# Altium project AC Dimming.PrjPcb (part 2 of 2)

## Sheet Sheet2.SchDoc
size A2; SheetNumber: 2; SheetTotal: 2
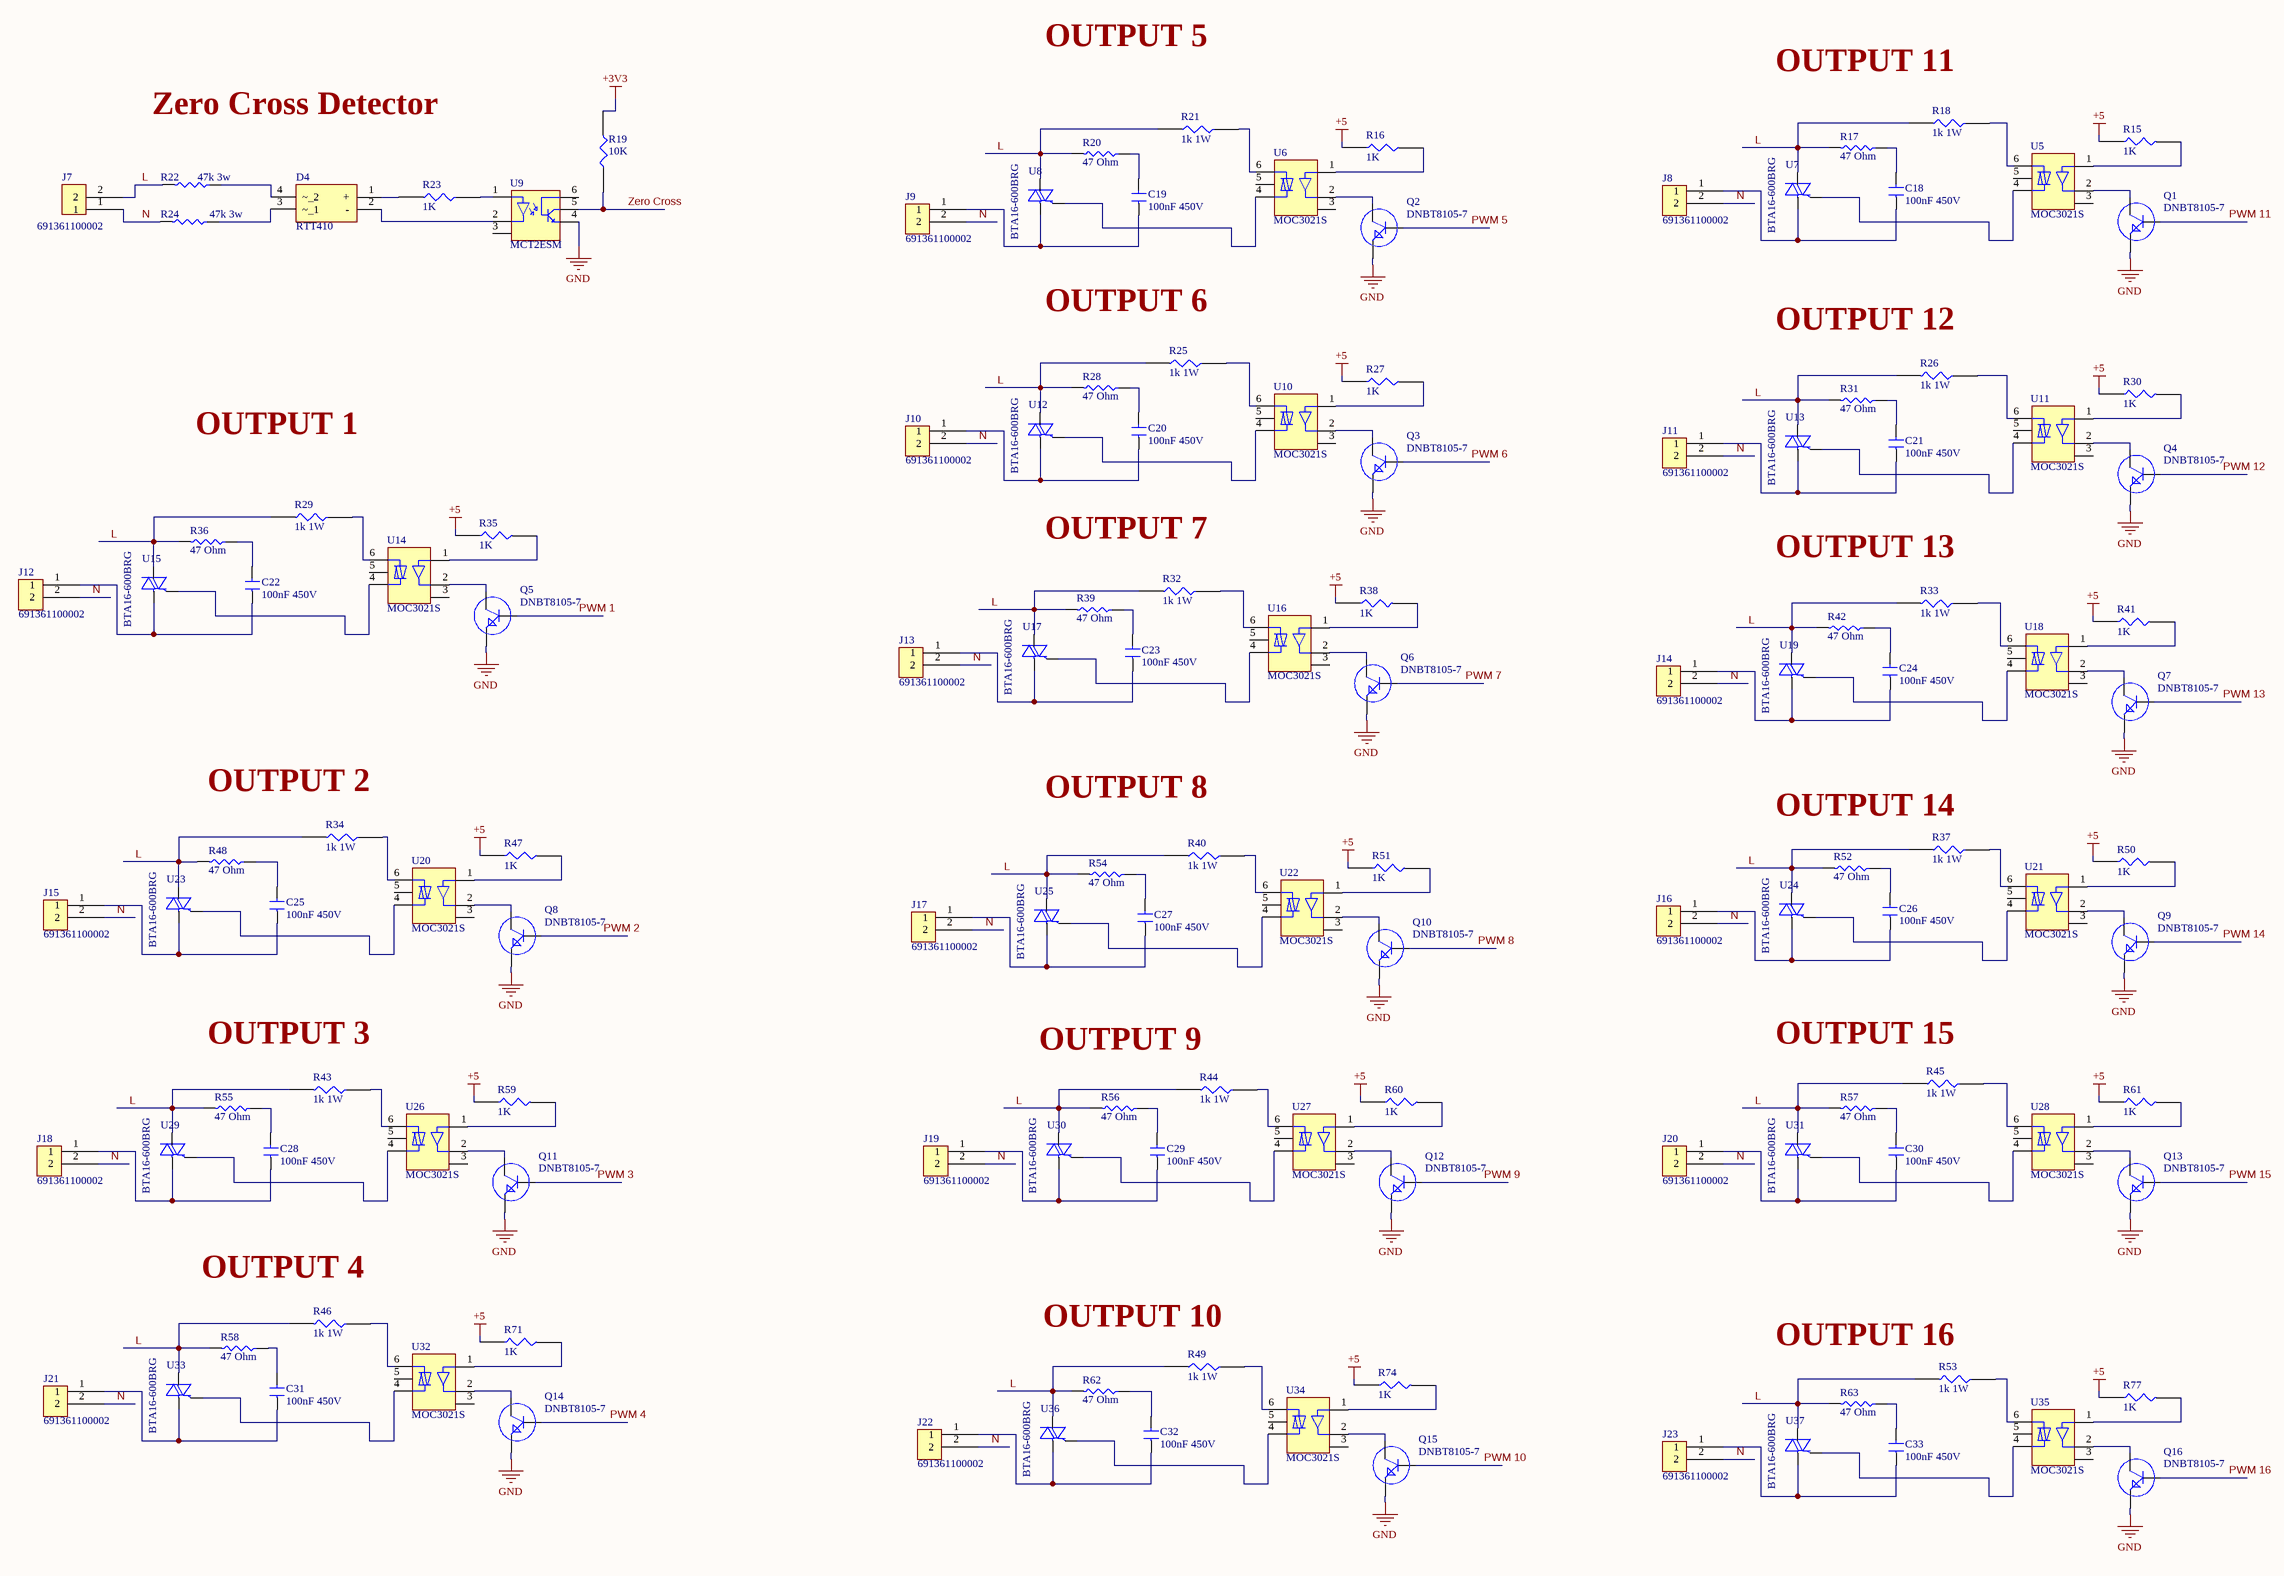
[diagram p1: Sheet2.SchDoc]

### Parts
C18  100nF 450V  [CAP 1206]
C19  100nF 450V  [CAP 1206]
C20  100nF 450V  [CAP 1206]
C21  100nF 450V  [CAP 1206]
C22  100nF 450V  [CAP 1206]
C23  100nF 450V  [CAP 1206]
C24  100nF 450V  [CAP 1206]
C25  100nF 450V  [CAP 1206]
C26  100nF 450V  [CAP 1206]
C27  100nF 450V  [CAP 1206]
C28  100nF 450V  [CAP 1206]
C29  100nF 450V  [CAP 1206]
C30  100nF 450V  [CAP 1206]
C31  100nF 450V  [CAP 1206]
C32  100nF 450V  [CAP 1206]
C33  100nF 450V  [CAP 1206]
D4  RTT410  [RT410]
J7  691361100002  [Screw Terminal 3.5mm]
J8  691361100002  [Screw Terminal 3.5mm]
J9  691361100002  [Screw Terminal 3.5mm]
J10  691361100002  [Screw Terminal 3.5mm]
J11  691361100002  [Screw Terminal 3.5mm]
J12  691361100002  [Screw Terminal 3.5mm]
J13  691361100002  [Screw Terminal 3.5mm]
J14  691361100002  [Screw Terminal 3.5mm]
J15  691361100002  [Screw Terminal 3.5mm]
J16  691361100002  [Screw Terminal 3.5mm]
J17  691361100002  [Screw Terminal 3.5mm]
J18  691361100002  [Screw Terminal 3.5mm]
J19  691361100002  [Screw Terminal 3.5mm]
J20  691361100002  [Screw Terminal 3.5mm]
J21  691361100002  [Screw Terminal 3.5mm]
J22  691361100002  [Screw Terminal 3.5mm]
J23  691361100002  [Screw Terminal 3.5mm]
Q1  DNBT8105-7  [SOT 223 3]
Q2  DNBT8105-7  [SOT 223 3]
Q3  DNBT8105-7  [SOT 223 3]
Q4  DNBT8105-7  [SOT 223 3]
Q5  DNBT8105-7  [SOT 223 3]
Q6  DNBT8105-7  [SOT 223 3]
Q7  DNBT8105-7  [SOT 223 3]
Q8  DNBT8105-7  [SOT 223 3]
Q9  DNBT8105-7  [SOT 223 3]
Q10  DNBT8105-7  [SOT 223 3]
Q11  DNBT8105-7  [SOT 223 3]
Q12  DNBT8105-7  [SOT 223 3]
Q13  DNBT8105-7  [SOT 223 3]
Q14  DNBT8105-7  [SOT 223 3]
Q15  DNBT8105-7  [SOT 223 3]
Q16  DNBT8105-7  [SOT 223 3]
R15  1K  [R_0805]
R16  1K  [R_0805]
R17  47 Ohm  [R 1206]
R18  1k 1W  [R_0805]
R19  10K  [R_0805]
R20  47 Ohm  [R 1206]
R21  1k 1W  [R_0805]
R22  47k 3w  [R 2512]
R23  1K  [R_0805]
R24  47k 3w  [R 2512]
R25  1k 1W  [R_0805]
R26  1k 1W  [R_0805]
R27  1K  [R_0805]
R28  47 Ohm  [R 1206]
R29  1k 1W  [R_0805]
R30  1K  [R_0805]
R31  47 Ohm  [R 1206]
R32  1k 1W  [R_0805]
R33  1k 1W  [R_0805]
R34  1k 1W  [R_0805]
R35  1K  [R_0805]
R36  47 Ohm  [R 1206]
R37  1k 1W  [R_0805]
R38  1K  [R_0805]
R39  47 Ohm  [R 1206]
R40  1k 1W  [R_0805]
R41  1K  [R_0805]
R42  47 Ohm  [R 1206]
R43  1k 1W  [R_0805]
R44  1k 1W  [R_0805]
R45  1k 1W  [R_0805]
R46  1k 1W  [R_0805]
R47  1K  [R_0805]
R48  47 Ohm  [R 1206]
R49  1k 1W  [R_0805]
R50  1K  [R_0805]
R51  1K  [R_0805]
R52  47 Ohm  [R 1206]
R53  1k 1W  [R_0805]
R54  47 Ohm  [R 1206]
R55  47 Ohm  [R 1206]
R56  47 Ohm  [R 1206]
R57  47 Ohm  [R 1206]
R58  47 Ohm  [R 1206]
R59  1K  [R_0805]
R60  1K  [R_0805]
R61  1K  [R_0805]
R62  47 Ohm  [R 1206]
R63  47 Ohm  [R 1206]
R71  1K  [R_0805]
R74  1K  [R_0805]
R77  1K  [R_0805]
U5  MOC3021S  [SMD 6]
U6  MOC3021S  [SMD 6]
U7  BTA16-600BRG  [BAT16]
U8  BTA16-600BRG  [BAT16]
U9  MCT2ESM  [SMD 6]
U10  MOC3021S  [SMD 6]
U11  MOC3021S  [SMD 6]
U12  BTA16-600BRG  [BAT16]
U13  BTA16-600BRG  [BAT16]
U14  MOC3021S  [SMD 6]
U15  BTA16-600BRG  [BAT16]
U16  MOC3021S  [SMD 6]
U17  BTA16-600BRG  [BAT16]
U18  MOC3021S  [SMD 6]
U19  BTA16-600BRG  [BAT16]
U20  MOC3021S  [SMD 6]
U21  MOC3021S  [SMD 6]
U22  MOC3021S  [SMD 6]
U23  BTA16-600BRG  [BAT16]
U24  BTA16-600BRG  [BAT16]
U25  BTA16-600BRG  [BAT16]
U26  MOC3021S  [SMD 6]
U27  MOC3021S  [SMD 6]
U28  MOC3021S  [SMD 6]
U29  BTA16-600BRG  [BAT16]
U30  BTA16-600BRG  [BAT16]
U31  BTA16-600BRG  [BAT16]
U32  MOC3021S  [SMD 6]
U33  BTA16-600BRG  [BAT16]
U34  MOC3021S  [SMD 6]
U35  MOC3021S  [SMD 6]
U36  BTA16-600BRG  [BAT16]
U37  BTA16-600BRG  [BAT16]

### Nets
+3V3: R19.1
+5: R15.2 R16.2 R27.2 R30.2 R35.2 R38.2 R41.2 R47.2 R50.2 R51.2 R59.2 R60.2 R61.2 R71.2 R74.2 R77.2
GND: Q1.2 Q2.2 Q3.2 Q4.2 Q5.2 Q6.2 Q7.2 Q8.2 Q9.2 Q10.2 Q11.2 Q12.2 Q13.2 Q14.2 Q15.2 Q16.2 U9.4
L: J7.2 R17.1 R18.1 R20.1 R21.1 R22.1 R25.1 R26.1 R28.1 R29.1 R31.1 R32.1 R33.1 R34.1 R36.1 R37.1 R39.1 R40.1 R42.1 R43.1 R44.1 R45.1 R46.1 R48.1 R49.1 R52.1 R53.1 R54.1 R55.1 R56.1 R57.1 R58.1 R62.1 R63.1 U7.2(A2) U8.2(A2) U12.2(A2) U13.2(A2) U15.2(A2) U17.2(A2) U19.2(A2) U23.2(A2) U24.2(A2) U25.2(A2) U29.2(A2) U30.2(A2) U31.2(A2) U33.2(A2) U36.2(A2) U37.2(A2)
N: J7.1 J8.2 J9.2 J10.2 J11.2 J12.2 J13.2 J14.2 J15.2 J16.2 J17.2 J18.2 J19.2 J20.2 J21.2 J22.2 J23.2 R24.1
PWM 1: Q5.1
PWM 2: Q8.1
PWM 3: Q11.1
PWM 4: Q14.1
PWM 5: Q2.1
PWM 6: Q3.1
PWM 7: Q6.1
PWM 8: Q10.1
PWM 9: Q12.1
PWM 10: Q15.1
PWM 11: Q1.1
PWM 12: Q4.1
PWM 13: Q7.1
PWM 14: Q9.1
PWM 15: Q13.1
PWM 16: Q16.1
Zero Cross: R19.2 U9.5
NetC18_1: C18.1 J8.1 U7.1(A1)
NetC18_2: C18.2 R17.2
NetC19_1: C19.1 J9.1 U8.1(A1)
NetC19_2: C19.2 R20.2
NetC20_1: C20.1 J10.1 U12.1(A1)
NetC20_2: C20.2 R28.2
NetC21_1: C21.1 J11.1 U13.1(A1)
NetC21_2: C21.2 R31.2
NetC22_1: C22.1 J12.1 U15.1(A1)
NetC22_2: C22.2 R36.2
NetC23_1: C23.1 J13.1 U17.1(A1)
NetC23_2: C23.2 R39.2
NetC24_1: C24.1 J14.1 U19.1(A1)
NetC24_2: C24.2 R42.2
NetC25_1: C25.1 J15.1 U23.1(A1)
NetC25_2: C25.2 R48.2
NetC26_1: C26.1 J16.1 U24.1(A1)
NetC26_2: C26.2 R52.2
NetC27_1: C27.1 J17.1 U25.1(A1)
NetC27_2: C27.2 R54.2
NetC28_1: C28.1 J18.1 U29.1(A1)
NetC28_2: C28.2 R55.2
NetC29_1: C29.1 J19.1 U30.1(A1)
NetC29_2: C29.2 R56.2
NetC30_1: C30.1 J20.1 U31.1(A1)
NetC30_2: C30.2 R57.2
NetC31_1: C31.1 J21.1 U33.1(A1)
NetC31_2: C31.2 R58.2
NetC32_1: C32.1 J22.1 U36.1(A1)
NetC32_2: C32.2 R62.2
NetC33_1: C33.1 J23.1 U37.1(A1)
NetC33_2: C33.2 R63.2
NetD4_1: D4.1(+) R23.1
NetD4_2: D4.2(-) U9.2
NetD4_3: D4.3(~_1) R24.2
NetD4_4: D4.4(~_2) R22.2
NetQ1_3: Q1.3 U5.2
NetQ2_3: Q2.3 U6.2
NetQ3_3: Q3.3 U10.2
NetQ4_3: Q4.3 U11.2
NetQ5_3: Q5.3 U14.2
NetQ6_3: Q6.3 U16.2
NetQ7_3: Q7.3 U18.2
NetQ8_3: Q8.3 U20.2
NetQ9_3: Q9.3 U21.2
NetQ10_3: Q10.3 U22.2
NetQ11_3: Q11.3 U26.2
NetQ12_3: Q12.3 U27.2
NetQ13_3: Q13.3 U28.2
NetQ14_3: Q14.3 U32.2
NetQ15_3: Q15.3 U34.2
NetQ16_3: Q16.3 U35.2
NetR15_1: R15.1 U5.1
NetR16_1: R16.1 U6.1
NetR18_2: R18.2 U5.6
NetR21_2: R21.2 U6.6
NetR23_2: R23.2 U9.1
NetR25_2: R25.2 U10.6
NetR26_2: R26.2 U11.6
NetR27_1: R27.1 U10.1
NetR29_2: R29.2 U14.6
NetR30_1: R30.1 U11.1
NetR32_2: R32.2 U16.6
NetR33_2: R33.2 U18.6
NetR34_2: R34.2 U20.6
NetR35_1: R35.1 U14.1
NetR37_2: R37.2 U21.6
NetR38_1: R38.1 U16.1
NetR40_2: R40.2 U22.6
NetR41_1: R41.1 U18.1
NetR43_2: R43.2 U26.6
NetR44_2: R44.2 U27.6
NetR45_2: R45.2 U28.6
NetR46_2: R46.2 U32.6
NetR47_1: R47.1 U20.1
NetR49_2: R49.2 U34.6
NetR50_1: R50.1 U21.1
NetR51_1: R51.1 U22.1
NetR53_2: R53.2 U35.6
NetR59_1: R59.1 U26.1
NetR60_1: R60.1 U27.1
NetR61_1: R61.1 U28.1
NetR71_1: R71.1 U32.1
NetR74_1: R74.1 U34.1
NetR77_1: R77.1 U35.1
NetU5_4: U5.4 U7.3(G)
NetU6_4: U6.4 U8.3(G)
NetU10_4: U10.4 U12.3(G)
NetU11_4: U11.4 U13.3(G)
NetU14_4: U14.4 U15.3(G)
NetU16_4: U16.4 U17.3(G)
NetU18_4: U18.4 U19.3(G)
NetU20_4: U20.4 U23.3(G)
NetU21_4: U21.4 U24.3(G)
NetU22_4: U22.4 U25.3(G)
NetU26_4: U26.4 U29.3(G)
NetU27_4: U27.4 U30.3(G)
NetU28_4: U28.4 U31.3(G)
NetU32_4: U32.4 U33.3(G)
NetU34_4: U34.4 U36.3(G)
NetU35_4: U35.4 U37.3(G)

Not connected (* = marked no-connect by the designer): U5 3 5; U6 3 5; U9 3 6; U10 3 5; U11 3 5; U14 3 5; U16 3 5; U18 3 5; U20 3 5; U21 3 5; U22 3 5; U26 3 5; U27 3 5; U28 3 5; U32 3 5; U34 3 5; U35 3 5

### Notes on the sheet
- OUTPUT 5
- OUTPUT 11
- Zero Cross Detector
- OUTPUT 6
- (near R26) OUTPUT 12
- OUTPUT 1
- OUTPUT 7
- (near R33) OUTPUT 13
- (near R34) OUTPUT 2
- OUTPUT 8
- (near R37) OUTPUT 14
- OUTPUT 3
- OUTPUT 9
- (near R45) OUTPUT 15
- (near R46) OUTPUT 4
- (near R49) OUTPUT 10
- (near R53) OUTPUT 16

### Library data of the parts
C18-C33 = Cap 100 nf 450V: Multilayer Ceramic Capacitor, 0.1 uF, 450 V, ± 10%, X7T, 1206 [3216 Metric]; Manufacturer: TDK; Manufacturer Part Number: CGA5L4X7T2W104K160AA; Supplier 1: RSComponents; RoHS: Yes; Category: Ceramic Capacitors; Stock 1: 610; Pricing 1: 10=0.47200, 100=0.44400, 250=0.41500, 500=0.39200, 1000=0.35400 (GBP); Mount: Surface Mount; Case/Package: 1206; Case Code (Metric): 3216; Case Code (Imperial): 1206; Weight: 0.000571oz; Min Operating Temperature: -55°C; Max Operating Temperature: 125°C; Capacitance: 100nF; Tolerance: 10%; Voltage Rating: 450V; Packaging: Tape and Reel; Voltage Rating (DC): 450V; Dielectric: X7T; Termination: SMD/SMT; Series: CGA; Package Quantity: 2000; Resistor Type: Ceramic; Length: 3.2mm; Width: 1.6mm; Height: 1.6mm; Thickness: 0.075inch; Depth: 1.6mm; Ratings: AEC-Q200; Lead Free: Lead Free; Reach SVHC Compliant: Yes; RoHS Compliant: Yes; ComponentLink1URL: https://datasheet.ciiva.com/24216/mlcc-automotive-midvoltage-en-355485-24216934.pdf?src-supplier=Mouser; ComponentLink1Description: https://datasheet.ciiva.com/24216/mlcc-automotive-midvoltage-en-355485-24216934.pdf?src-supplier=Mouser; ComponentLink2URL: https://datasheet.ciiva.com/8079/1807242-8079356.pdf?src-supplier=Element14; ComponentLink2Description: https://datasheet.ciiva.com/8079/1807242-8079356.pdf?src-supplier=Element14; Supplier Part Number 1: 9038849
D4 = RTT410: Manufacturer: Diodes; Supplier 1: Avnet; Manufacturer Part Number: RTT410; RoHS: No; Category: Uncategorized; Stock 1: 6000; Pricing 1: 1500=0.10358, 3000=0.09986, 6000=0.09686, 9000=0.09403, 12000=0.09050, 15000=0.08908, 150000=0.08767 (USD); Supplier Part Number 1: RTT410
J7-J23 = Screw Tarminal 3.5mm pitch: 3611 Series 3.5mm Pitch Straight Pluggable Term Block; Plug; Cable Mount; 2 Way; Manufacturer: Wurth Electronics; Current Rating: 10A; Voltage Rating: 300V; Number of Positions Per Level: 2; Number of Levels: 1; Wire/Cable Gauge: 26AWG; Wire Gauge (Min): 16AWG; Pitch: 0.138inch; Stripping Length: -7mm; Supplier 1: RSComponents; Manufacturer Part Number: 691361100002; RoHS: Yes; Category: Terminal Blocks; Stock 1: 1; Pricing 1: 1=2.51400, 10=2.28700, 50=2.12400, 100=2.02300, 250=1.93500 (USD); Mount: Free Hanging; Color: Green; Contact Material: Brass; Package Quantity: 650; Packaging: Bulk; Termination: Screw; Current: 10A; Voltage: 300V; Number of Contacts: 2; Series: WR-TBL Series 3611; Length: 15.8mm; Width: 3.5mm; Height: 11.1mm; Wire Gauge (Max): 26AWG; REACH SVHC: Unknown; RoHS Compliant: Yes; Lead Free: Lead Free; ComponentLink1URL: https://datasheet.ciiva.com/7992/1442235-7992395.pdf?src-supplier=Element14; ComponentLink1Description: https://datasheet.ciiva.com/7992/1442235-7992395.pdf?src-supplier=Element14; ComponentLink2URL: https://datasheet.ciiva.com/796/6913611000xx-796028.pdf?src-supplier=Digi-Key; ComponentLink2Description: https://datasheet.ciiva.com/796/6913611000xx-796028.pdf?src-supplier=Digi-Key; Supplier Part Number 1: 8250806
Q1-Q16 = NPN 1A: TRANS NPN 60V 1A SOT23-3; Manufacturer: Diodes Zetex; Number of Terminals/Pins: 3; Package Body Material: Plastic; Transistor Element Material: SILICON; Max Power Dissipation: 600mW; Collector Base Voltage (VCBO): 80V; hFE Min: 30; Number of Elements: 1; Frequency: 150MHz; Emitter Base Voltage (VEBO): 5V; Collector Emitter Saturation Voltage: 500mV; Power Dissipation: 300mW; Element Configuration: Single; Time @ Peak Reflow Temperature-Max (s): 10s; Transistor Application: SWITCHING; Additional Feature: HIGH RELIABILITY; Supplier 1: RSComponents; Manufacturer Part Number: DNBT8105-7; RoHS: Yes; Category: BJTs; Stock 1: 1; Pricing 1: 50=0.36000, 600=0.17300, 1500=0.16800 (USD); Mount: Surface Mount; Case/Package: SOT-23; Number of Pins: 3; Weight: 0.000282oz; Contact Plating: Tin,Matte; Terminal Finish: Tin; Package Shape: Rectangular; Min Operating Temperature: -55°C; Max Operating Temperature: 150°C; Collector Emitter Voltage (VCEO): 60V; Max Collector Current: 1A; Packaging: Tape and Reel; Package Quantity: 3000; Polarity: NPN; Collector Emitter Breakdown Voltage: 60V; Transition Frequency: 150MHz; Max Breakdown Voltage: 60V; Gain Bandwidth Product: 150MHz; Voltage Rating (DC): 60V; Current Rating: 1A; Collector-emitter Voltage-Max: 500mV; Series: -; Moisture Sensitivity Level: 1; JESD-30 Code: R-PDSO-G3; Surface Mount: Yes; Terminal Form: Gull Wing; Terminal Position: DUAL; Peak Reflow Temperature (Cel): 260°C; DC Current Gain-Min (hFE): 30; Length: 2.9mm; Width: 1.3mm; Height: 1mm; Radiation Hardening: No; REACH SVHC: No SVHC; Lead Free: Lead Free; RoHS Compliant: Yes; ComponentLink1URL: https://datasheet.ciiva.com/34302/1590567-34302596.pdf?src-supplier=Jameco; ComponentLink1Description: https://datasheet.ciiva.com/34302/1590567-34302596.pdf?src-supplier=Jameco; ComponentLink2URL: https://datasheet.ciiva.com/22711/ds30513-22711715.pdf?src-supplier=Element14; ComponentLink2Description: https://datasheet.ciiva.com/22711/ds30513-22711715.pdf?src-supplier=Element14; ComponentLink3URL: https://datasheet.ciiva.com/11201/ds30513-11201713.pdf?src-supplier=Avnet; ComponentLink3Description: https://datasheet.ciiva.com/11201/ds30513-11201713.pdf?src-supplier=Avnet; ComponentLink4URL: https://datasheet.ciiva.com/8029/ds30513-8029483.pdf?src-supplier=Element14; ComponentLink4Description: https://datasheet.ciiva.com/8029/ds30513-8029483.pdf?src-supplier=Element14; Supplier Part Number 1: 7114923P
R15 R16 R23 R27 R30 R35 R38 R41 R47 R50 R51 R59-R61 R71 R74 R77 = RES_1_K_0805: 贴片电阻 1000Ω ± 1.00% 0.125W ± 100ppm/℃ 0805; Manufacturer: Yageo; Manufacturer Part Number: RC0805FR-071KL; Tolerance: 1%; Resistance: 1kR; Temperature Coefficient: 100ppm/°C; Voltage Rating (DC): 150V; Power Rating: 125mW; Supplier 1: Future Electronics; RoHS: Yes; Category: Chip SMD Resistors; Stock 1: 10195000; Pricing 1: 5000=0.00390 (USD); Case/Package: 0805; Number of Pins: 2; Case Code (Metric): 2012; Case Code (Imperial): 0805; Size Code: 0805; Min Operating Temperature: -55°C; Max Operating Temperature: 155°C; Packaging: Tape and Reel; Resistor Type: Thick Film; Package Quantity: 1; Voltage Rating: 150V; Number of Terminations: 2; Termination: SMD/SMT; Max Power Dissipation: 125mW; Features: Moisture Resistant; Series: RC; Resistance Tolerance: 1%; Construction: Rectangular; Length: 0.079inch; Width: 0.049inch; Height: 0.024inch; Depth: 1.25mm; REACH SVHC: Unknown; Lead Free: Lead Free; RoHS Compliant: Yes; Military Standard: Not; ComponentLink1URL: https://datasheet.ciiva.com/7941/1686128-7941719.pdf?src-supplier=Element14; ComponentLink1Description: https://datasheet.ciiva.com/7941/1686128-7941719.pdf?src-supplier=Element14; ComponentLink2URL: https://datasheet.ciiva.com/46385/444164-46385020.pdf?src-supplier=Element14; ComponentLink2Description: https://datasheet.ciiva.com/46385/444164-46385020.pdf?src-supplier=Element14; ComponentLink3URL: https://datasheet.ciiva.com/2456/pyu-r-int-thick-7-2456976.pdf?src-supplier=Digi-Key; ComponentLink3Description: https://datasheet.ciiva.com/2456/pyu-r-int-thick-7-2456976.pdf?src-supplier=Digi-Key; ComponentLink4URL: https://datasheet.ciiva.com/2456/pyu-r-int-thick-7-2456977.pdf?src-supplier=Digi-Key; ComponentLink4Description: https://datasheet.ciiva.com/2456/pyu-r-int-thick-7-2456977.pdf?src-supplier=Digi-Key; ComponentLink5URL: https://datasheet.ciiva.com/2456/pyu-r-int-thick-7-2456975.pdf?src-supplier=Digi-Key; ComponentLink5Description: https://datasheet.ciiva.com/2456/pyu-r-int-thick-7-2456975.pdf?src-supplier=Digi-Key; ComponentLink6URL: https://datasheet.ciiva.com/16850/rc0805-16850409.pdf?src-supplier=Future+Electronics; ComponentLink6Description: https://datasheet.ciiva.com/16850/rc0805-16850409.pdf?src-supplier=Future+Electronics; Supplier Part Number 1: 8126013
R17 R20 R28 R31 R36 R39 R42 R48 R52 R54-R58 R62 R63 = Res 47 oHm 1/2 W: Res Thick Film 1206 47 Ohm 1% 1/2W ±200ppm/°C Molded SMD Paper T/R; Manufacturer: TE Connectivity; Manufacturer Part Number: CRGH1206F47R; Resistance: 47R; Power Rating: 500mW; Voltage Rating: 200V; Number of Resistors: 1; Supplier 1: Digi-Key; RoHS: Yes; Category: Chip SMD Resistors; Stock 1: 107811; Pricing 1: 1=0.17000, 10=0.14200, 100=0.05540, 1000=0.02318, 2500=0.02124 (USD); Mount: Surface Mount; Case/Package: 1206; Case Code (Metric): 3216; Case Code (Imperial): 1206; Min Operating Temperature: -55°C; Max Operating Temperature: 155°C; Tolerance: 1%; Packaging: Tape and Reel; Resistor Type: Thick Film; Temperature Coefficient: 200ppm/°C; Number of Terminations: 2; Termination: Solder; Series: CRGH, Neohm; Max Power Dissipation: 500mW; Voltage Rating (DC): 200V; Resistance Tolerance: 1%; ELV: Compliant; RoHS Compliant: Yes; Reach SVHC Compliant: Yes; ComponentLink1URL: http://farnell.com//datasheets/1755795.pdf?src-supplier=Farnell; ComponentLink1Description: http://farnell.com//datasheets/1755795.pdf?src-supplier=Farnell; ComponentLink2URL: http://www.farnell.com/datasheets/1755795.pdf?src-supplier=Farnell; ComponentLink2Description: http://www.farnell.com/datasheets/1755795.pdf?src-supplier=Farnell; ComponentLink3URL: https://www.te.com/commerce/DocumentDelivery/DDEController?Action=srchrtrv&amp;DocNm=1773204-1&amp;DocType=DS&amp;DocLang=English&src-supplier=Digi-Key; ComponentLink3Description: https://www.te.com/commerce/DocumentDelivery/DDEController?Action=srchrtrv&amp;DocNm=1773204-1&amp;DocType=DS&amp;DocLang=English&src-supplier=Digi-Key; ComponentLink4URL: http://www.farnell.com/datasheets/1755795.pdf?src-supplier=Element14; ComponentLink4Description: http://www.farnell.com/datasheets/1755795.pdf?src-supplier=Element14; ComponentLink5URL: http://www.te.com/commerce/DocumentDelivery/DDEController?Action=srchrtrv&DocNm=1309350_PASSIVE_COMPONENT&DocType=CS&DocLang=English&src-supplier=Digi-Key; ComponentLink5Description: http://www.te.com/commerce/DocumentDelivery/DDEController?Action=srchrtrv&DocNm=1309350_PASSIVE_COMPONENT&DocType=CS&DocLang=English&src-supplier=Digi-Key; Supplier Part Number 1: A129227CT-ND
R18 R21 R25 R26 R29 R32-R34 R37 R40 R43-R46 R49 R53 = Res 1K 1W: Manufacturer: TE Connectivity; Manufacturer Part Number: RA73F2A1K0BTD; Supplier 1: Digi-Key; RoHS: No; Category: Chip SMD Resistors; Stock 1: 7849; Pricing 1: 1=1.46000, 10=1.29300, 100=0.93830, 1000=0.55466, 2500=0.54215 (USD); Supplier Part Number 1: 1712-RA73F2A1K0BTDCT-ND
R19 = RES_10_K_0805: 贴片电阻 10000Ω ± 1.00% 0.125W ± 100ppm/℃ 0805; Manufacturer: Yageo; Manufacturer Part Number: RC0805FR-0710KL; Resistance: 10kR; Tolerance: 1%; Temperature Coefficient: 100ppm/°C; Power Rating: 125mW; Voltage Rating: 150V; Supplier 1: Avnet; RoHS: Yes; Category: Chip SMD Resistors; Stock 1: 725000; Pricing 1: 5000=0.00227, 10000=0.00224, 20000=0.00217 (USD); Case/Package: 0805; Case Code (Imperial): 0805; Case Code (Metric): 2012; Size Code: 0805; Min Operating Temperature: -55°C; Max Operating Temperature: 155°C; Packaging: Tape and Reel; Resistor Type: Thick Film; Package Quantity: 1; Termination: SMD/SMT; Number of Terminations: 2; Max Power Dissipation: 125mW; Features: Moisture Resistant; Series: RC; Construction: Rectangular; Resistance Tolerance: 1%; Technology: THICK FILM; Length: 2mm; Width: 0.049inch; Height: 0.024inch; Depth: 1.25mm; REACH SVHC: Unknown; Lead Free: Lead Free; Military Standard: Not; RoHS Compliant: Yes; Supplier Part Number 1: RC0805FR-0710KL
R22 R24 = RES 47K 3W SMD: Res Thick Film 2512 47K Ohm 5% 3W ±100ppm/C Pad SMD T/R; Manufacturer: TE Connectivity CGS; Manufacturer Part Number: 352247KJT; Resistance: 47kR; Voltage Rating: 250V; Number of Resistors: 1; Temperature Coefficient: 100ppm/°C; Supplier 1: Avnet; RoHS: Yes; Category: Chip SMD Resistors; Stock 1: 32; Pricing 1: 1=0.45000 (USD); Mount: Surface Mount; Case/Package: 2512; Case Code (Metric): 6432; Case Code (Imperial): 2512; Min Operating Temperature: -55°C; Max Operating Temperature: 155°C; Power Rating: 3W; Packaging: Tape and Reel; Resistor Type: Thick Film,Power resistor; Termination: Solder; Tolerance: 5%; Voltage Rating (DC): 250V; Number of Terminations: 2; Features: Automotive AEC-Q200; Series: 3522, CGS; Max Power Dissipation: 3W; Resistance Tolerance: 5%; Technology: THICK FILM; Length: 6.35mm; Height: 1.1mm; Depth: 3.2mm; Ratings: AEC-Q200; RoHS Compliant: Yes; ComponentLink1URL: http://www.farnell.com/datasheets/2007092.pdf?src-supplier=Farnell; ComponentLink1Description: http://www.farnell.com/datasheets/2007092.pdf?src-supplier=Farnell; ComponentLink2URL: http://uk.rs-online.com/webdocs/142d/0900766b8142d139.pdf?src-supplier=RSComponents; ComponentLink2Description: http://uk.rs-online.com/webdocs/142d/0900766b8142d139.pdf?src-supplier=RSComponents; ComponentLink3URL: https://www.te.com/commerce/DocumentDelivery/DDEController?Action=srchrtrv&amp;DocNm=9-1773463-7&amp;DocType=DS&amp;DocLang=English&src-supplier=Digi-Key; ComponentLink3Description: https://www.te.com/commerce/DocumentDelivery/DDEController?Action=srchrtrv&amp;DocNm=9-1773463-7&amp;DocType=DS&amp;DocLang=English&src-supplier=Digi-Key; ComponentLink4URL: http://www.farnell.com/datasheets/2007092.pdf?src-supplier=Element14; ComponentLink4Description: http://www.farnell.com/datasheets/2007092.pdf?src-supplier=Element14; Supplier Part Number 1: 84Y5180
U5 U6 U10 U11 U14 U16 U18 U20-U22 U26-U28 U32 U34 U35 = MOC3021S: MOC302x Series 1 Channel 400 V 5000 Vrms Surface Mount Triac Optocoupler - SMD-6; Manufacturer: Vishay Lite-On; Forward Voltage: 1.15V; Number of Channels: 1; Hold Current: 250uA; Forward Current: 50mA; Max Input Voltage: 1.5V; Power Dissipation: 330mW; Reverse Breakdown Voltage: 6V; Isolation Voltage: 5kV; Output Voltage: 400V; Turn-On Delay Time: 20us; Approvals: UL,CSA,VDE,TUV,CQC; Supplier 1: RSComponents; Manufacturer Part Number: MOC3021S; RoHS: Yes; Category: Optocouplers; Stock 1: 5; Pricing 1: 65=0.31800 (GBP); Mount: Surface Mount; Case/Package: SMD/SMT; Number of Pins: 6; Min Operating Temperature: -40°C; Max Operating Temperature: 100°C; Packaging: Rail/Tube; Package Quantity: 65; Nominal Input Voltage: 1.15V; Number of Elements: 1; Number of Circuits: 1; Series: -; Max Input Current: 50mA; Radiation Hardening: No; RoHS Compliant: Yes; ComponentLink1URL: https://datasheet.ciiva.com/15118/getdatasheetpartid-237228-15118280.pdf?src-supplier=Verical; ComponentLink1Description: https://datasheet.ciiva.com/15118/getdatasheetpartid-237228-15118280.pdf?src-supplier=Verical; ComponentLink2URL: https://datasheet.ciiva.com/25620/0900766b80de6ded-25620538.pdf?src-supplier=RSComponents; ComponentLink2Description: https://datasheet.ciiva.com/25620/0900766b80de6ded-25620538.pdf?src-supplier=RSComponents; ComponentLink3URL: https://datasheet.ciiva.com/25769/0900766b80de6ded-25769902.pdf?src-supplier=Allied+Electronics; ComponentLink3Description: https://datasheet.ciiva.com/25769/0900766b80de6ded-25769902.pdf?src-supplier=Allied+Electronics; ComponentLink4URL: https://datasheet.ciiva.com/2093/s-110-moc3020thrumoc3023series-2093402.pdf?src-supplier=Digi-Key; ComponentLink4Description: https://datasheet.ciiva.com/2093/s-110-moc3020thrumoc3023series-2093402.pdf?src-supplier=Digi-Key; Supplier Part Number 1: 1689686
U7 U8 U12 U13 U15 U17 U19 U23-U25 U29-U31 U33 U36 U37 = Triac: TRIAC Standard 600V 16A Through Hole TO-220AB
U9 = MCT2ESM: DC-IN 1-CH Transistor With Base DC-OUT 6-Pin PDIP SMD; Manufacturer: ON Semiconductor / Fairchild; Max Power Dissipation: 250mW; Number of Channels: 1; Collector Emitter Voltage (VCEO): 400mV; Reverse Breakdown Voltage: 3V; Forward Voltage: 1.25V; Forward Current: 60mA; Max Collector Current: 50mA; Max Output Voltage: 30V; Rise Time: 2us; Isolation Voltage: 7.5kV; Fall Time: 1.5us; Input Type: DC; Supplier 1: Digi-Key; Manufacturer Part Number: MCT2ESM; RoHS: Yes; Category: Optocouplers; Stock 1: 971; Pricing 1: 1=0.72000, 10=0.46900, 100=0.30730, 1000=0.24263, 2000=0.22646, 5000=0.21837, 10000=0.21514, 25000=0.21028 (USD); Mount: Surface Mount; Case/Package: SMD/SMT; Number of Pins: 6; Weight: 0.81g; Min Operating Temperature: -55°C; Max Operating Temperature: 100°C; Packaging: Bulk; Package Quantity: 1000; Collector Emitter Saturation Voltage: 400mV; Output Current per Channel: 50mA; Max Input Current: 60mA; Number of Elements: 1; Power Dissipation: 250mW; Number of Circuits: 1; Output Voltage: 30V; Series: -; Collector-emitter Voltage-Max: 400mV; Lead Free: Lead Free; RoHS Compliant: Yes; ComponentLink1URL: https://datasheet.ciiva.com/2087/mct2em-2087121.pdf?src-supplier=Digi-Key; ComponentLink1Description: https://datasheet.ciiva.com/2087/mct2em-2087121.pdf?src-supplier=Digi-Key; Supplier Part Number 1: MCT2ESM-ND

## Nets that join several sheets
+3V3: Sheet1 (19 pins), Sheet2 (R19.1)
+5: Sheet1 (11 pins), Sheet2 (16 pins)
GND: Sheet1 (38 pins), Sheet2 (17 pins)
PWM 1: Sheet1 (U1.23), Sheet2 (Q5.1)
PWM 2: Sheet1 (U1.24), Sheet2 (Q8.1)
PWM 3: Sheet1 (U1.25), Sheet2 (Q11.1)
PWM 4: Sheet1 (U1.26), Sheet2 (Q14.1)
PWM 5: Sheet1 (U1.31), Sheet2 (Q2.1)
PWM 6: Sheet1 (U1.32), Sheet2 (Q3.1)
PWM 7: Sheet1 (U1.35), Sheet2 (Q6.1)
PWM 8: Sheet1 (U1.36), Sheet2 (Q10.1)
PWM 9: Sheet1 (U1.45), Sheet2 (Q12.1)
PWM 10: Sheet1 (U1.44), Sheet2 (Q15.1)
PWM 11: Sheet1 (U1.42), Sheet2 (Q1.1)
PWM 12: Sheet1 (U1.40), Sheet2 (Q4.1)
PWM 13: Sheet1 (U1.59), Sheet2 (Q7.1)
PWM 14: Sheet1 (U1.60), Sheet2 (Q9.1)
PWM 15: Sheet1 (U1.61), Sheet2 (Q13.1)
PWM 16: Sheet1 (U1.62), Sheet2 (Q16.1)
Zero Cross: Sheet1 (U1.15), Sheet2 (R19.2 U9.5)